# Altium schematic sheet FPGA.SchDoc: ZoM Mod A - FPGA
size A4; Organization: Trenz Electronic GmbH; DocumentNumber: 5; Revision: 01; SheetNumber: 5; SheetTotal: 13; Date: 12/16/2014
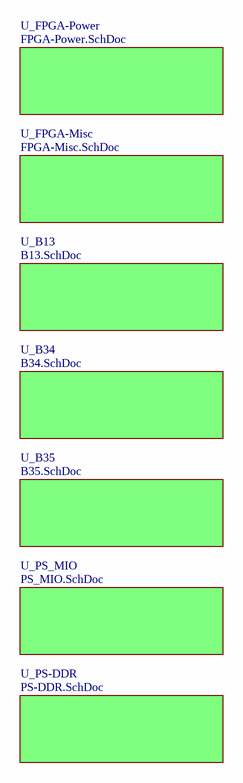
[diagram p0: FPGA.SchDoc]

## Sub-sheets
U_B13 = B13.SchDoc: no entries
U_B34 = B34.SchDoc: no entries
U_B35 = B35.SchDoc: no entries
U_FPGA-Misc = FPGA-Misc.SchDoc: no entries
U_FPGA-Power = FPGA-Power.SchDoc: no entries
U_PS-DDR = PS-DDR.SchDoc: no entries
U_PS_MIO = PS_MIO.SchDoc: no entries

## Notes on the sheet
- Title:
- Number:
- Rev.
- Date:
- A4
- Copyright:
- Page
- of
- Filename: